# Altium project carte_pami2026.PrjPcb
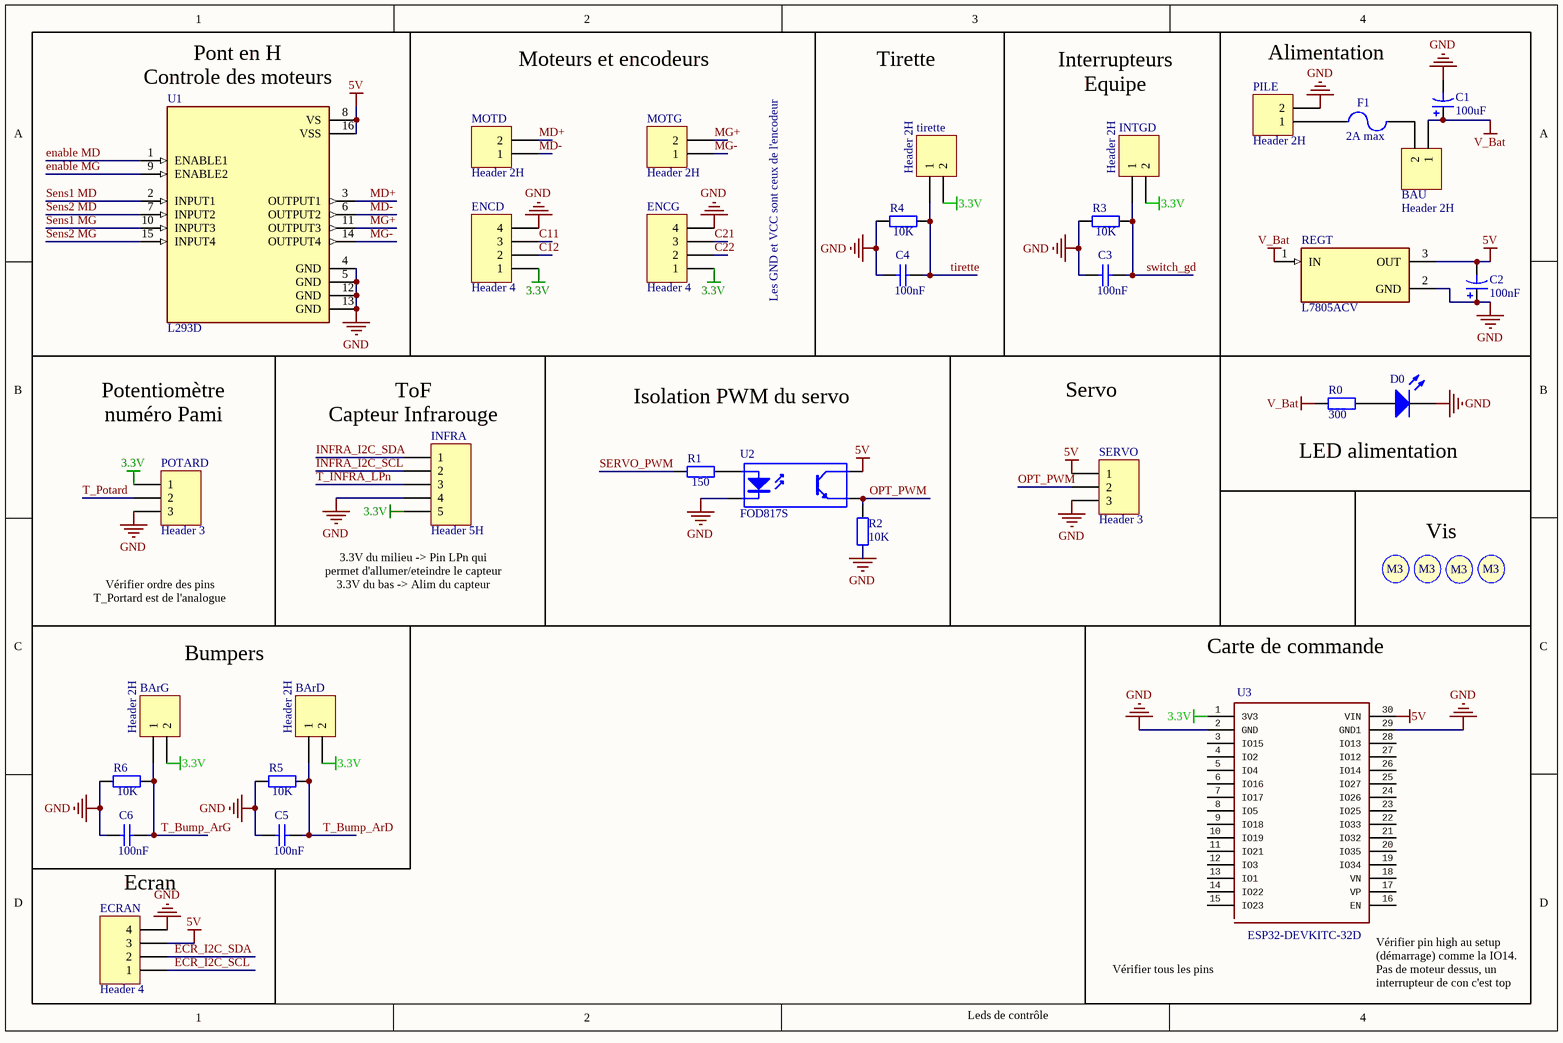
[diagram p0: carte_pami2026.SchDoc]
1 sheet, 37 parts. Net scope: global (net labels, ports and power ports of the same name join across sheets).

## Sheet carte_pami2026.SchDoc
size A4; SheetNumber: 1; SheetTotal: 1

### Parts
BArD  Header 2H  [JST_B2B-XH-A_(LF)(SN)]
BArG  Header 2H  [JST_B2B-XH-A_(LF)(SN)]
BAU  Header 2H  [JST_B2B-XH-A_(LF)(SN)]
C1  value 100uF  [Condensateur]  (hidden comment: 35V)
C2  value 100nF  [Condensateur]  (hidden comment: 35V)
C3  value 100nF  [Capacitor 1206]  (hidden comment: Cap)
C4  value 100nF  [Capacitor 1206]  (hidden comment: Cap)
C5  value 100nF  [Capacitor 1206]  (hidden comment: Cap)
C6  value 100nF  [Capacitor 1206]  (hidden comment: Cap)
D0  L  [KP-3216SEC]  (value not drawn)
ECRAN  Header 4  [B4BXHALFSN]
ENCD  Header 4  [B4BXHALFSN]
ENCG  Header 4  [B4BXHALFSN]
F1  2A max  [Fuse]
INFRA  Header 5H  [B5BXHAMLFSN]
INTGD  Header 2H  [JST_B2B-XH-A_(LF)(SN)]
MOTD  Header 2H  [JST_B2B-XH-A_(LF)(SN)]
MOTG  Header 2H  [JST_B2B-XH-A_(LF)(SN)]
PILE  Header 2H  [JST_B2B-XH-A_(LF)(SN)]
POTARD  Header 3  [JST_B3B-XH-A(LF)(SN)]
R0  value 300  [Resistor 1206]  (hidden comment: Res2)
R1  value 150  [Resistor 1206]  (hidden comment: Res2)
R2  value 10K  [Resistor 1206]  (hidden comment: Res2)
R3  value 10K  [Resistor 1206]  (hidden comment: Res2)
R4  value 10K  [Resistor 1206]  (hidden comment: Res2)
R5  value 10K  [Resistor 1206]  (hidden comment: Res2)
R6  value 10K  [Resistor 1206]  (hidden comment: Res2)
REGT  L7805ACV  [TO254P460X1020X1945-3P]
S1  Screw M3  [Screw M3]  (value not drawn)
S2  Screw M3  [Screw M3]  (value not drawn)
S3  Screw M3  [Screw M3]  (value not drawn)
S4  Screw M3  [Screw M3]  (value not drawn)
SERVO  Header 3  [JST_B3B-XH-A(LF)(SN)]
tirette  Header 2H  [JST_B2B-XH-A_(LF)(SN)]
U1  L293D  [DIP880W50P254L2000H510Q16]
U2  FOD817S  [SOP254P1016X385-4N]
U3  ESP32-DEVKITC-32D  [MODULE_ESP32-DEVKITV1]

### Blocks framed on the sheet
Moteurs et encodeurs: ENCD ENCG MOTD MOTG
Tirette: C4 R4 tirette
Alimentation: BAU C1 C2 F1 PILE REGT
Isolation PWM du servo: R1 R2 U2
Servo: SERVO
Vis: S1-S4
Carte de commande: U3

### Nets
3.3V: BArD.2 BArG.2 ENCD.1 ENCG.1 INFRA.5 INTGD.2 POTARD.1 tirette.2 U3.1(3V3)
5V: C2.2 ECRAN.3 REGT.3(OUT) SERVO.1 U1.8(VS) U1.16(VSS) U2.4(C) U3.30(VIN)
GND: C1.2 C2.1 C3.1 C4.1 C5.1 C6.1 D0.2(K) ECRAN.4 ENCD.4 ENCG.4 INFRA.4 PILE.2 POTARD.3 R2.1 R3.1 R4.1 R5.1 R6.1 REGT.2(GND) SERVO.3 U1.4(GND) U1.5(GND) U1.12(GND) U1.13(GND) U2.2(K) U3.2(GND) U3.29(GND1)
V_Bat: BAU.1 C1.1 R0.1 REGT.1(IN)
C11: ENCD.3
C12: ENCD.2
C21: ENCG.3
C22: ENCG.2
ECR_I2C_SCL: ECRAN.1
ECR_I2C_SDA: ECRAN.2
enable MD: U1.1(ENABLE1)
enable MG: U1.9(ENABLE2)
INFRA_I2C_SCL: INFRA.2
INFRA_I2C_SDA: INFRA.1
MD+: MOTD.2 U1.3(OUTPUT1)
MD-: MOTD.1 U1.6(OUTPUT2)
MG+: MOTG.2 U1.11(OUTPUT3)
MG-: MOTG.1 U1.14(OUTPUT4)
OPT_PWM: R2.2 SERVO.2 U2.3(E)
Sens1 MD: U1.2(INPUT1)
Sens1 MG: U1.10(INPUT3)
Sens2 MD: U1.7(INPUT2)
Sens2 MG: U1.15(INPUT4)
SERVO_PWM: R1.1
switch_gd: C3.2 INTGD.1 R3.2
T_Bump_ArD: BArD.1 C5.2 R5.2
T_Bump_ArG: BArG.1 C6.2 R6.2
T_INFRA_LPn: INFRA.3
T_Potard: POTARD.2
tirette: C4.2 R4.2 tirette.1
NetBAU_2: BAU.2 F1.1
NetD0_1: D0.1(A) R0.2
NetF1_2: F1.2 PILE.1
NetR1_2: R1.2 U2.1(A)

Not connected (* = marked no-connect by the designer): U3 3(IO15) 4(IO2) 5(IO4) 6(IO16) 7(IO17) 8(IO5) 9(IO18) 10(IO19) 11(IO21) 12(IO3) 13(IO1) 14(IO22) 15(IO23) 16(EN) 17(VP) 18(VN) 19(IO34) 20(IO35) 21(IO32) 22(IO33) 23(IO25) 24(IO26) 25(IO27) 26(IO14) 27(IO12) 28(IO13)

### Notes on the sheet
- (near U1) Pont en H
  Controle des moteurs
- Interrupteurs
  Equipe
- Les GND et VCC sont ceux de l'encodeur
- Potentiomètre
  numéro Pami
- (near INFRA) ToF
  Capteur Infrarouge
- LED alimentation
- Vérifier ordre des pins
  T_Portard est de l'analogue
- (near INFRA) 3.3V du milieu -> Pin LPn qui permet d'allumer/eteindre le capteur
  3.3V du bas -> Alim du capteur
- Bumpers
- Ecran
- Vérifier tous les pins
- (near U3) Vérifier pin high au setup (démarrage) comme la IO14. Pas de moteur dessus, un interrupteur de con c'est top
- Leds de contrôle
- (in symbol Screw M3) M3

### Library data of the parts
BArD BArG BAU INTGD MOTD MOTG PILE tirette = Header 2H: Header, 2-Pin, Right Angle; LatestRevisionDate: 17-Jul-2002; LatestRevisionNote: Re-released for DXP Platform.; Publisher: Altium Limited
C1 C2 = Cap Pol1: Polarized Capacitor (Radial); Published: 8-Jun-2000; LatestRevisionDate: 17-Jul-2002; LatestRevisionNote: Re-released for DXP Platform.; PackageReference: RB7.6-15; Publisher: Altium Limited; PackageDescription: Polarized Capacitor (Radial); 2 Leads
C3-C6 = Cap: Capacitor; Published: 8-Jun-2000; LatestRevisionDate: 17-Jul-2002; LatestRevisionNote: Re-released for DXP Platform.; PackageReference: RAD-0.3; Publisher: Altium Limited; PackageDescription: Radial Cap, Thru-Hole; 2 Leads; 0.3 in Pin Spacing
D0 = LED2: Typical RED, GREEN, YELLOW, AMBER GaAs LED; Published: 8-Jun-2000; LatestRevisionDate: 17-Jul-2002; LatestRevisionNote: Re-released for DXP Platform.; PackageVersion: Feb-2002; PackageReference: 3.2X1.6X1.1; Publisher: Altium Limited; PackageDescription: SM LED; 2 Flat Leads
ECRAN ENCD ENCG = Header 4: Header, 4-Pin; LatestRevisionDate: 17-Jul-2002; LatestRevisionNote: Re-released for DXP Platform.; Publisher: Altium Limited
F1 = Fuse 2: Main Fuse; Published: 8-Jun-2000; LatestRevisionDate: 17-Jul-2002; LatestRevisionNote: Re-released for DXP Platform.; PackageReference: PIN-W2/E2.8; Publisher: Altium Limited; PackageDescription: Thru-Hole; 2 Leads
INFRA = Header 5H: Header, 5-Pin, Right Angle; LatestRevisionDate: 17-Jul-2002; LatestRevisionNote: Re-released for DXP Platform.; Publisher: Altium Limited
POTARD SERVO = Header 3: Header, 3-Pin; LatestRevisionDate: 17-Jul-2002; LatestRevisionNote: Re-released for DXP Platform.; Publisher: Altium Limited
R0-R6 = Res2: Resistor; Published: 8-Jun-2000; LatestRevisionDate: 17-Jul-2002; LatestRevisionNote: Re-released for DXP Platform.; PackageReference: AXIAL-0.4; Publisher: Altium Limited; PackageDescription: Axial Device, Thru-Hole; 2 Leads; 0.4 in Pin Spacing
REGT = L7805ACV: Linear Voltage Regulator IC Positive Fixed 1 Output 1.5A TO-220; MF: STMicroelectronics; SnapEDA_Link: https://www.snapeda.com/parts/L7805ACV/STMicroelectronics/view-part/?ref=snap; Package: TO-220-3 STMicroelectronics; Value: *; MP: L7805ACV; Check_prices: https://www.snapeda.com/parts/L7805ACV/STMicroelectronics/view-part/?ref=eda
U1 = L293D: Bipolar Motor Driver - Parallel 16-PowerDIP; MF: STMicroelectronics; MP: L293D; Package: DIP-16 STMicroelectronics; SnapEDA_Link: https://www.snapeda.com/parts/L293D/STMicroelectronics/view-part/?ref=snap; Purchase-URL: https://pricing.snapeda.com/search/part/L293D/?ref=eda; Check_prices: https://www.snapeda.com/parts/L293D/STMicroelectronics/view-part/?ref=eda; Availability: In Stock; Value: *; Price: None
U2 = Optoisolator1: 4-Pin Phototransistor Optocoupler; Published: 24-Mar-1999; LatestRevisionDate: 04-Mar-2005; LatestRevisionNote: Sch pins 3 & 4 Swapped.; DatasheetVersion: Nov-2003; PackageReference: DIP-4; Publisher: Altium Limited
U3 = ESP32-DEVKITC-32D: Eval Board For Esp-Wroom-32; MF: Espressif Systems; Availability: Unavailable; Package: None; SnapEDA_Link: https://www.snapeda.com/parts/ESP32-DEVKITC-32D/Espressif%20Systems/view-part/?ref=snap; MP: ESP32-DEVKITC-32D; Price: None; Value: *